# EAGLE design eth2dmx (EAGLE 9.2.2)
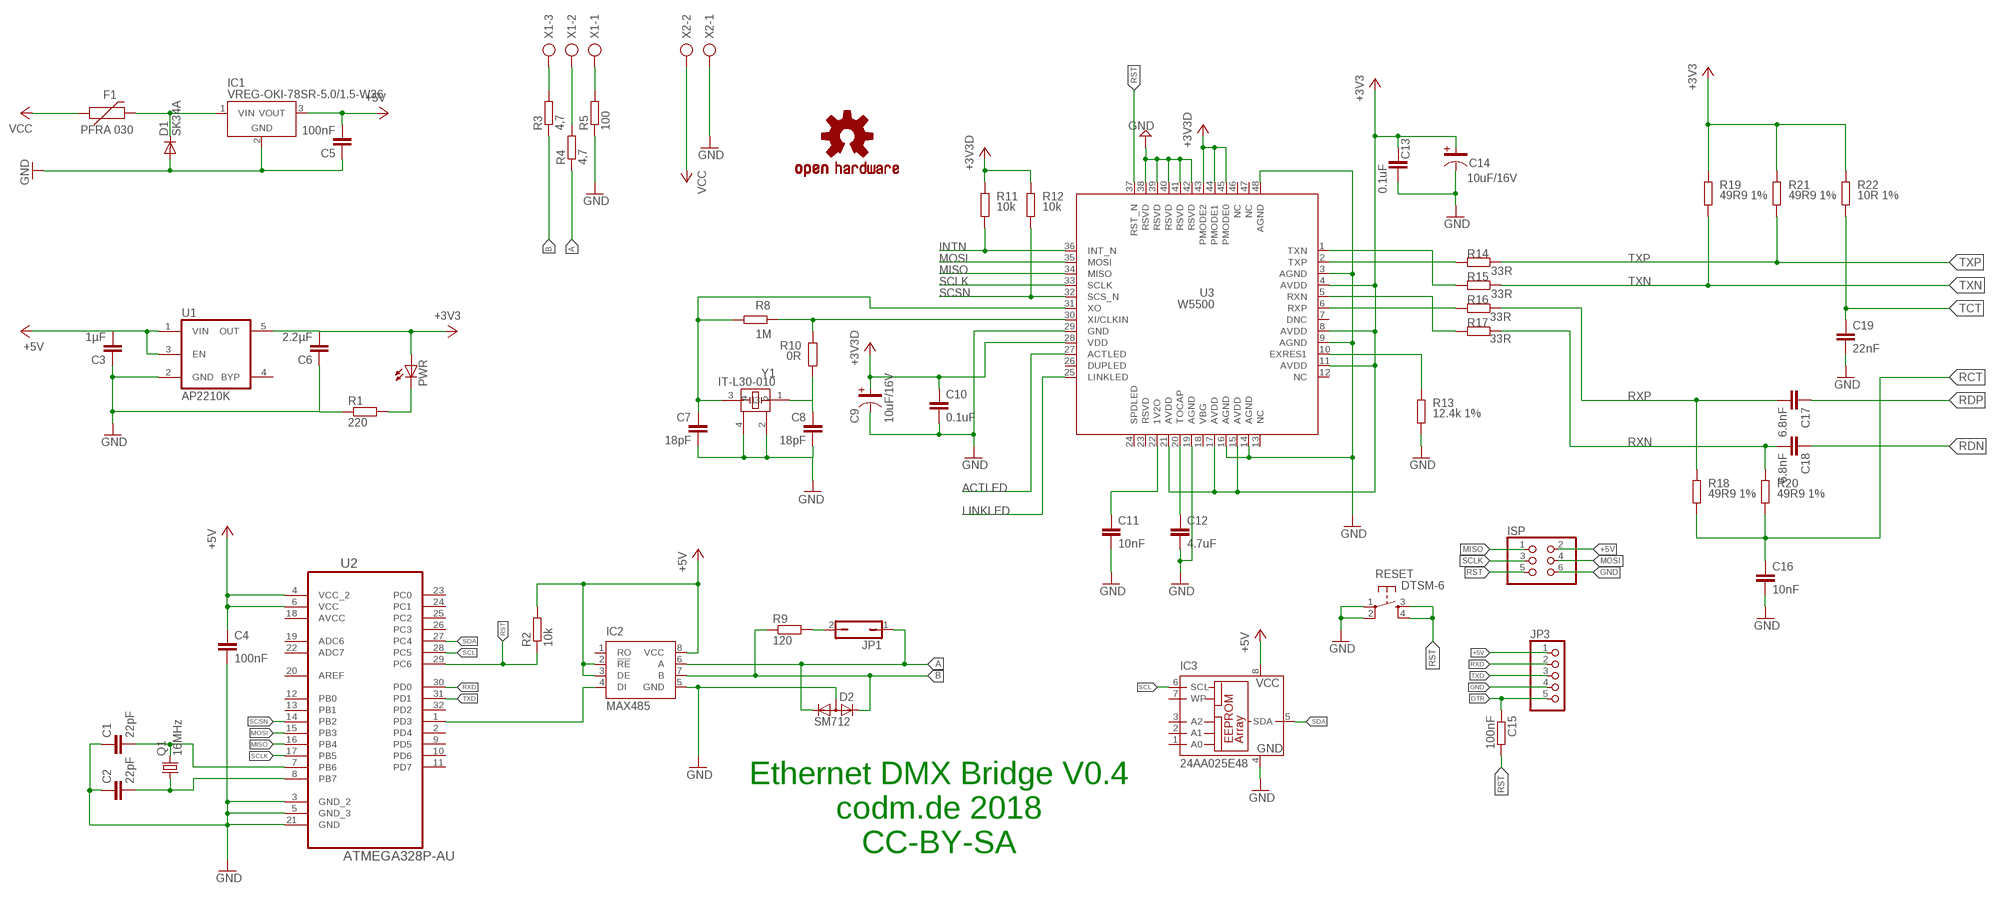
[diagram p0: schematic, sheet 1, part 1 of 2]
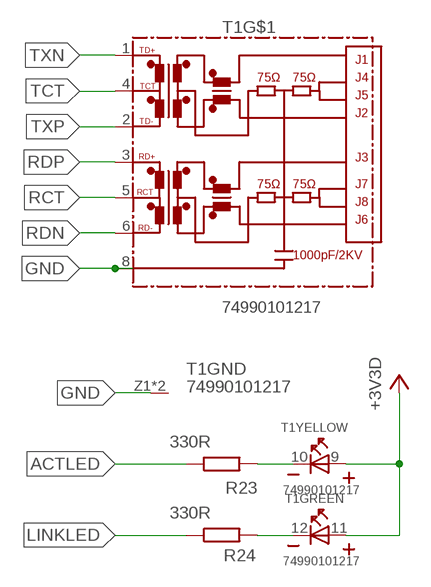
[diagram p1: schematic, sheet 1, part 2 of 2]

## Parts
C1  22pF  C-EUC0805  [C0805]
C2  22pF  C-EUC0805  [C0805]
C3  1µF  C-EUC0805  [C0805]
C4  100nF  C-EUC0805  [C0805]
C5  100nF  C-EUC0805  [C0805]
C6  2.2µF  C-EUC0805  [C0805]
C7  18pF  C-EUC0805  [C0805]
C8  18pF  C-EUC0805  [C0805]
C9  10uF/16V  C-3216(TANTAL)  [C-3216(TANTAL)]
C10  0.1uF  C-EUC0805  [C0805]
C11  10nF  C-EUC0805  [C0805]
C12  4.7uF  C-EUC0805  [C0805]
C13  0.1uF  C-EUC0805  [C0805]
C14  10uF/16V  C-3216(TANTAL)  [C-3216(TANTAL)]
C15  100nF  R-EU_R0805  [R0805]
C16  10nF  C-EUC0805  [C0805]
C17  6.8nF  C-EUC0805  [C0805]
C18  6.8nF  C-EUC0805  [C0805]
C19  22nF  C-EUC0805  [C0805]
D1  SK34A  DIODE-DO214AC  [DO214AC]
D2  SM712  DIODE-2CA|ACSOT23  [SOT23]
F1  PFRA 030  PPTC_PTH  [PTH]
IC1  VREG-OKI-78SR-5.0/1.5-W36  [OKI-78SR]
IC2  MAX485  LTC485S  [SOIC8]
IC3  24AA025E48  24AA02SN  [SO-08]
ISP  PINHD-2X3  [2X03]
JP1  JP1Q  [JP1]
JP3  PINHD-1X5  [1X05]
LOGO1  OSHW-LOGOM  [OSHW-LOGO-M]
PWR  LEDCHIP-LED0805  [CHIP-LED0805]
Q1  16MHz  CRYSTALHC49U70  [HC49U70]
R1  220  R-EU_R0805  [R0805]
R2  10k  R-EU_R0805  [R0805]
R3  4,7  R-EU_R0805  [R0805]
R4  4,7  R-EU_R0805  [R0805]
R5  100  R-EU_R0805  [R0805]
R8  1M  R-EU_R0805  [R0805]
R9  120  R-EU_R0805  [R0805]
R10  0R  R-EU_R0805  [R0805]
R11  10k  R-EU_R0805  [R0805]
R12  10k  R-EU_R0805  [R0805]
R13  12.4k 1%  R-EU_R0805  [R0805]
R14  33R  R-EU_R0805  [R0805]
R15  33R  R-EU_R0805  [R0805]
R16  33R  R-EU_R0805  [R0805]
R17  33R  R-EU_R0805  [R0805]
R18  49R9 1%  R-EU_R0805  [R0805]
R19  49R9 1%  R-EU_R0805  [R0805]
R20  49R9 1%  R-EU_R0805  [R0805]
R21  49R9 1%  R-EU_R0805  [R0805]
R22  10R 1%  R-EU_R0805  [R0805]
R23  330R  R-EU_R0805  [R0805]
R24  330R  R-EU_R0805  [R0805]
RESET  DTSM-6  [DTSM-6]
T1  74990101217  WE-RJ45_74990111217  [74990111217]
U1  AP2210K  [SOT23-5]
U2  ATMEGA328P-AU  [QFP80P900X900X120-32N]
U3  W5500  [W5500]
X1  AK500/3  [AK500/3]
X2  AK500/2  [AK500/2]
Y1  IT-L30-010  [IT-L30-010]

## Nets
+3V3: C6.2 C9.1 C10.1 C13.1 C14.1 PWR.A R11.2 R12.2 R19.2 R21.2 R22.2 T1.9(YELLOW:A) T1.11(GREEN:A) U1.5(OUT) U3.4(AVDD) U3.8(AVDD) U3.11(AVDD) U3.15(AVDD) U3.17(AVDD) U3.21(AVDD) U3.28(VDD) U3.43(PMODE2) U3.44(PMODE1) U3.45(PMODE0) ; supply symbol labelled +3V3D
+5V: C3.2 C4.1 C5.2 IC1.3(VOUT) IC2.2(!RE) IC2.3(DE) IC2.8(VCC) IC3.8(VCC) ISP.2 JP3.1 R2.2 U1.1(VIN) U1.3(EN) U2.4(VCC_2) U2.6(VCC)
A: D2.1(K1) IC2.6(A) JP1.1 R4.1
ACTLED: R23.1 U3.27(ACTLED)
B: D2.2(K2) IC2.7(B) R3.1 R9.1
DOUT: IC2.4(DI) U2.1(PD3)
DTR: C15.1 JP3.5
GND: C1.1 C2.1 C3.1 C4.2 C5.1 C6.1 C7.2 C8.2 C9.2 C10.2 C11.2 C12.2 C13.2 C14.2 C16.2 C19.2 D1.A D2.3(A) IC1.2(GND) IC2.5(GND) IC3.4(GND) ISP.6 JP3.4 R1.1 R5.1 R13.1 RESET.1 RESET.2 T1.8 T1.Z1(GND:GND) T1.Z2(GND:GND) U1.2(GND) U2.3(GND_2) U2.5(GND_3) U2.21(GND) U3.3(AGND) U3.9(AGND) U3.14(AGND) U3.16(AGND) U3.19(AGND) U3.29(GND) U3.38(RSVD) U3.39(RSVD) U3.40(RSVD) U3.41(RSVD) U3.42(RSVD) U3.48(AGND) X2.1 Y1.2 Y1.4
INTN: R11.1 U3.36(INT_N)
LINKLED: R24.1 U3.25(LINKLED)
MISO: ISP.1 U2.16(PB4) U3.34(MISO)
MOSI: ISP.4 U2.15(PB3) U3.35(MOSI)
N$1: C12.1 U3.20(TOCAP)
N$2: C2.2 Q1.1 U2.8(PB7)
N$3: C1.2 Q1.2 U2.7(PB6)
N$4: R5.2 X1.1
N$5: R3.2 X1.3
N$6: R4.2 X1.2
N$7: PWR.C R1.2
N$8: D1.C F1.P$2 IC1.1(VIN)
N$11: R8.2 R10.2 U3.30(XI/CLKIN)
N$13: JP1.2 R9.2
N$15: C11.1 U3.22(1V2O)
N$17: R13.2 U3.10(EXRES1)
N$20: R16.2 U3.6(RXP)
N$22: C7.1 R8.1 U3.31(XO) Y1.3
N$26: R17.2 U3.5(RXN)
N$27: R14.2 U3.2(TXP)
N$28: R15.2 U3.1(TXN)
N$29: C8.1 R10.1 Y1.1
N$34: R23.2 T1.10(YELLOW:K)
N$35: R24.2 T1.12(GREEN:K)
RCT: C16.1 R18.1 R20.1 T1.5(RCT)
RDN: C18.1 T1.6(RD-)
RDP: C17.1 T1.3(RD+)
RST: C15.2 ISP.5 R2.1 RESET.3 RESET.4 U2.29(PC6) U3.37(RST_N)
RXD: JP3.2 U2.30(PD0)
RXN: C18.2 R17.1 R20.2
RXP: C17.2 R16.1 R18.2
SCL: IC3.6(SCL) U2.28(PC5)
SCLK: ISP.3 U2.17(PB5) U3.33(SCLK)
SCSN: R12.1 U2.14(PB2) U3.32(SCS_N)
SDA: IC3.5(SDA) U2.27(PC4)
TCT: C19.1 R22.1 T1.4(TCT)
TXD: JP3.3 U2.31(PD1)
TXN: R15.1 R19.1 T1.1(TD+)
TXP: R14.1 R21.1 T1.2(TD-)
VCC: F1.P$1 X2.2
Unconnected: IC2.1(RO) IC3.1(A0) IC3.2(A1) IC3.3(A2) IC3.7(WP) U1.4(BYP) U2.2(PD4) U2.9(PD5) U2.10(PD6) U2.11(PD7) U2.12(PB0) U2.13(PB1) U2.19(ADC6) U2.20(AREF) U2.22(ADC7) U2.23(PC0) U2.24(PC1) U2.25(PC2) U2.26(PC3) U2.32(PD2) U3.7(DNC) U3.12(NC) U3.13(NC) U3.18(VBG) U3.23(RSVD) U3.24(SPDLED) U3.26(DUPLED) U3.46(NC) U3.47(NC)

## Notes on the sheet
- Ethernet DMX Bridge V0.4
  codm.de 2018
  CC-BY-SA

## Power pins joined to a net without a drawn wire
AVCC: U2.18(AVCC)

## Library data of the parts
C1-C8 C10-C13 C16-C19 = rcl:C-EU: CAPACITOR, European symbol; SPICEPREFIX: C
C9 C14 = CAP:C-3216(TANTAL)
C15 R1-R5 R8-R24 = rcl:R-EU_: RESISTOR, European symbol; SPICEPREFIX: R
D1 = diode:DIODE-: DIODE
D2 = diode:DIODE-2CA|AC: Dual DIODE Cathode-Anode|Anode-Cathode
F1 = SparkFun-Fuses:PPTC: Resettable Fuse PPTC Resettable Fuse. Really a sort of resistor with a polymeric positive temperature coefficient whose resistance increases dramatically with an increase in temperature. When heated by the power passing through the resistance rises causing the current to be limited, protecting the circuit. This is achieved by the transition of the polymer from a crystalline to an amorphous state where the conductive carbon separates breaking the conductive pathways found in the cool crystalline structure. When a PPTC cools back down it resumes conducting letting the circuit turn back on. SparkFun Products: SparkFun RedBoard - Programmed with Arduino <https://www.sparkfun.com/products/12757> Pro Micro - 5V/16MHz <https://www.sparkfun.com/products/12640> Arduino Pro 328 - 5V/16MHz <https://www.sparkfun.com/products/10915> MP3 Trigger <https://www.sparkfun.com/products/13720>; PROD_ID: RES-08490; VALUE: 72V/0.25A
IC1 = we-power:VREG: Voltage Regulators (LDOs, Switching Converters...) LDOs Taiwan Semi TS1117 800mA max 15V - compatible On Semi NCP1117 1A max 20V - compatible Diodes AP2111H 0.6A max 6V (0.25V@0.6A) - compatible Diodes AP2114H 1A max 6V (0.45V@1A) Taiwan Semi TS9011 250mA max 12V - compatible Diodes AP2210 300mA max 15V - compatible Microchip MCP1700 250mA max 6.5V - compatible Microchip MCP1702 250mA max 13V - compatible Microchip MCP1703 250mA max 16V - compatible Microchip MCP1754 150mA max 16V Taiwan Semi TS5204 150mA max 16V (low noise) DC/DC Converter Modules Recom R-78Ex.x-1.0-W36 1A max 28V - compatible CUI V78xx-2000 2A max 18V Murata OKI-78SR-x.x/1.5-W36 1.5A max 36V
IC2 = linear-technology:LTC485: Low Power RS485 Interface Transceiver Source: http://www.linear.com/pc/downloadDocument.do?navId=H0,C1,C1007,C1017,P2064,D1718; OC_FARNELL: unknown; OC_NEWARK: unknown
IC3 = microchip:24*: Serial EEPROM I2C; MPN: 24AA02/SN; OC_FARNELL: 1331272; OC_NEWARK: 89C9793
ISP = pinhead:PINHD-2X3: PIN HEADER
JP1 = jumper:JP1Q: JUMPER
JP3 = pinhead:PINHD-1X5: PIN HEADER
LOGO1 = SparkFun-Aesthetics:OSHW-LOGO: Open-Source Hardware (OSHW) Logo This logo indicates the piece of hardware it is found on incorporates a OSHW license and/or adheres to the definition of open source hardware found here: http://freedomdefined.org/OSHW
PWR = led:LED: LED OSRAM: - CHIPLED LG R971, LG N971, LY N971, LG Q971, LY Q971, LO R971, LY R971 LH N974, LH R974 LS Q976, LO Q976, LY Q976 LO Q996 - Hyper CHIPLED LW Q18S LB Q993, LB Q99A, LB R99A - SideLED LS A670, LO A670, LY A670, LG A670, LP A670 LB A673, LV A673, LT A673, LW A673 LH A674 LY A675 LS A676, LA A676, LO A676, LY A676, LW A676 LS A679, LY A679, LG A679 - Hyper Micro SIDELED® LS Y876, LA Y876, LO Y876, LY Y876 LT Y87S - SmartLED LW L88C, LW L88S LB L89C, LB L89S, LG L890 LS L89K, LO L89K, LY L89K LS L896, LA L896, LO L896, LY L896 - TOPLED LS T670, LO T670, LY T670, LG T670, LP T670 LSG T670, LSP T670, LSY T670, LOP T670, LYG T670 LG T671, LOG T671, LSG T671 LB T673, LV T673, LT T673, LW T673 LH T674 LS T676, LA T676, LO T676, LY T676, LB T676, LH T676, LSB T676, LW T676 LB T67C, LV T67C, LT T67C, LS T67K, LO T67K, LY T67K, LW E67C LS E67B, LA E67B, LO E67B, LY E67B, LB E67C, LV E67C, LT E67C LW T67C LS T679, LY T679, LG T679 LS T770, LO T770, LY T770, LG T770, LP T770 LB T773, LV T773, LT T773, LW T773 LH T774 LS E675, LA E675, LY E675, LS T675 LS T776, LA T776, LO T776, LY T776, LB T776 LHGB T686 LT T68C, LB T68C - Hyper Mini TOPLED® LB M676 - Mini TOPLED Santana® LG M470 LS M47K, LO M47K, LY M47K Source: http://www.osram.convergy.de LUXEON: - LUMILED® LXK2-PW12-R00, LXK2-PW12-S00, LXK2-PW14-U00, LXK2-PW14-V00 LXK2-PM12-R00, LXK2-PM12-S00, LXK2-PM14-U00 LXK2-PE12-Q00, LXK2-PE12-R00, LXK2-PE12-S00, LXK2-PE14-T00, LXK2-PE14-U00 LXK2-PB12-K00, LXK2-PB12-L00, LXK2-PB12-M00, LXK2-PB14-N00, LXK2-PB14-P00, LXK2-PB14-Q00 LXK2-PR12-L00, LXK2-PR12-M00, LXK2-PR14-Q00, LXK2-PR14-R00 LXK2-PD12-Q00, LXK2-PD12-R00, LXK2-PD12-S00 LXK2-PH12-R00, LXK2-PH12-S00 LXK2-PL12-P00, LXK2-PL12-Q00, LXK2-PL12-R00 Source: www.luxeon.com KINGBRIGHT: KA-3528ASYC Source: www.kingbright.com
Q1 = adafruit:CRYSTAL: CRYSTAL; OC_FARNELL: unknown; OC_NEWARK: unknown
RESET = switch-tact:DTSM-6
T1 = SignalCommunications (rev17d):WE-RJ45_74990111217: Order Code 74990111217 Design THT xBase-T 10/100 Base-T Ports 1x1 Application Standard HPLE Tab Position Up LED (Left-Right) yellow-green EMI Fingers YES <http://katalog.we-online.de/media/images/v2/Family_RJ45_drei(2).jpg> Details see: http://katalog.we-online.de/en/pbs/WE-LAN-RJ45/74990111217 <http://katalog.we-online.de/en/pbs/WE-LAN-RJ45/74990111217?> Created by Yingchun Shan 2014-07-10 2016 (C) Würth Elektronik
U1 = diodes-inc:AP2210: LDO REGULATOR
U2 = Atmel_By_element14_Batch_1-00:ATMEGA328P-AU: 8-bit Microcontroller with In-System Programmable Flash; MPN: ATMEGA328P-AU; OC_FARNELL: 1715486; OC_NEWARK: 14R4631; PACKAGE: TQFP-32; SUPPLIER: Atmel
U3 = W5500:W5500
X1 = con-ptr500:AK500/3: CONNECTOR; OC_FARNELL: unknown; OC_NEWARK: unknown
X2 = con-ptr500:AK500/2: CONNECTOR; OC_FARNELL: unknown; OC_NEWARK: unknown
Y1 = IT-L30-010:IT-L30-010

## Board
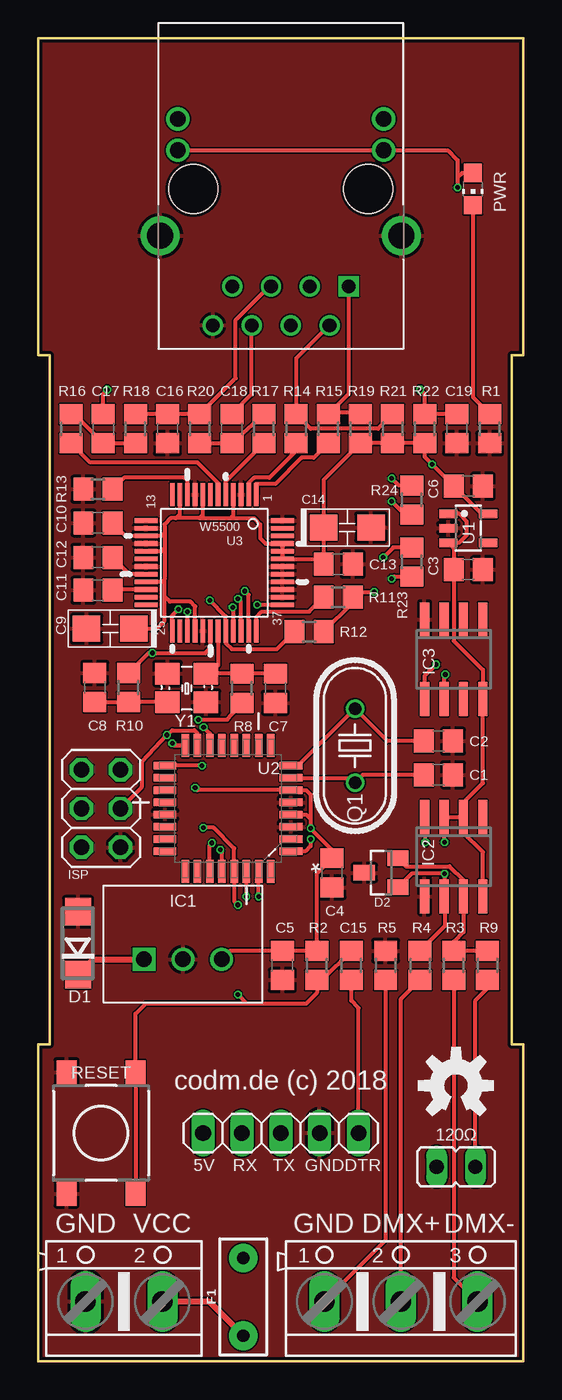
[diagram p2: board, top side]
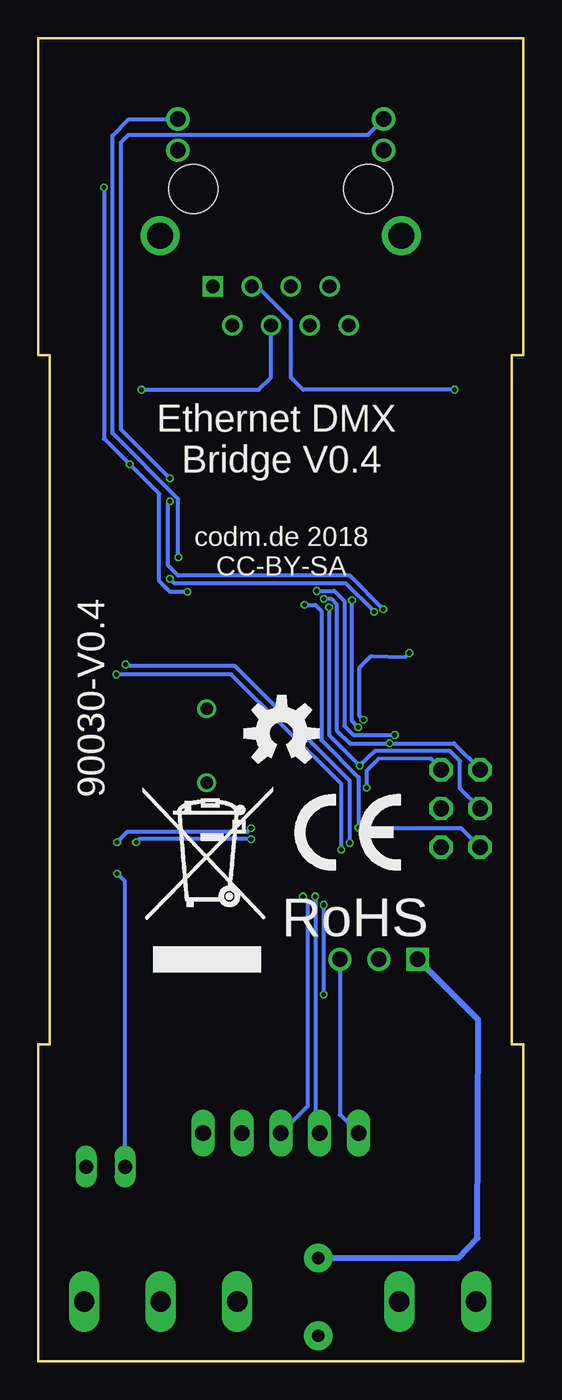
[diagram p3: board, bottom side, seen from below]

Size 31.7 x 86.4 mm. Coordinates in mm from the lower left corner, seen from the top.
Outline: 0,0 0,20.7 0.75,20.7 0.75,65.7 0,65.7 0,86.4 31.7,86.4 31.7,65.7 30.95,65.7 30.95,20.7 31.7,20.7 31.7,0 0,0
Copper layers (1*16): Top 0.018mm / dielectric 1.55mm / Bottom 0.018mm
Design rules "Multi-CB_2L_100um-Tracks_OL35um": minimum track width 0.1mm, minimum drill 0.2mm, track to track 0.1mm, track to pad 0.1mm, pad to pad 0.1mm, via to via 0.1mm, smd to smd 0mil, copper to edge 0.2mm, drill to drill 0.2mm, minimum pad ring 0.125mm, minimum via ring 0.1mm, stop-mask expansion 2mil, vias tented up to drill 0.45mm, thermal gap 0.2mm

### Footprints (pad centres in the part's own frame; a part is rotated, then mirrored left to right if it is on the bottom)
C0805 = smd 1.3 x 1.5: 1 -0.95,0; 2 0.95,0
C-3216(TANTAL) = smd 1.8 x 1.7: 1 1.55,0; 2 -1.55,0
R0805 = smd 1.3 x 1.5: 1 -0.95,0; 2 0.95,0
DO214AC = smd 1.8 x 1.7: A 2.05,0; C -2.05,0
SOT23 = smd 1 x 1.4: 1 -0.95,-1.1; 2 0.95,-1.1; 3 0,1.1
PTH = drill 0.8 pad 1.88: P$1 -2.54,0; P$2 2.54,0
OKI-78SR = drill 1 pad 1.5 square: 1 -2.54,0 | drill 1 pad 1.5: 2 0,0; 3 2.54,0
SOIC8 = smd 0.6 x 2.2: 1 -1.905,-2.6; 2 -0.635,-2.6; 3 0.635,-2.6; 4 1.905,-2.6; 5 1.905,2.6; 6 0.635,2.6; 7 -0.635,2.6; 8 -1.905,2.6
SO-08 = smd 0.6 x 2.2: 1 -1.905,-2.6; 2 -0.635,-2.6; 3 0.635,-2.6; 4 1.905,-2.6; 5 1.905,2.6; 6 0.635,2.6; 7 -0.635,2.6; 8 -1.905,2.6
2X03 = drill 1.016 octagon: 1 -2.54,-1.27; 2 -2.54,1.27; 3 0,-1.27; 4 0,1.27; 5 2.54,-1.27; 6 2.54,1.27
JP1 = drill 0.914 long: 1 0,-1.27; 2 0,1.27
1X05 = drill 1.016 long: 1 -5.08,0; 2 -2.54,0; 3 0,0; 4 2.54,0; 5 5.08,0
CHIP-LED0805 = smd 1.2 x 1.2: A 0,-1.05; C 0,1.05
HC49U70 = drill 0.813: 1 -2.413,0; 2 2.413,0
DTSM-6 = smd 1.55 x 1.3: 1 -3.975,2.25; 2 3.975,2.25; 3 -3.975,-2.25; 4 3.975,-2.25
74990111217 = drill 0.89 square: 1 4.44,-6.35 | drill 0.89: 2 3.18,-8.89; 3 1.9,-6.35; 4 0.64,-8.89; 5 -0.64,-6.35; 6 -1.9,-8.89; 7 -3.18,-6.35; 8 -4.44,-8.89 | drill 1.02: 9 6.725,2.54; 10 6.725,4.57; 11 -6.725,2.54; 12 -6.725,4.57 | drill 1.7: Z1 -7.875,-3.05; Z2 7.875,-3.05 | hole 3.2: -5.715,0; 5.715,0
SOT23-5 = smd 0.55 x 1.2: 1 -0.95,-1.3; 2 0,-1.3; 3 0.95,-1.3; 4 0.95,1.3; 5 -0.95,1.3
QFP80P900X900X120-32N = smd 1.473 x 0.508: 1 -4.115,2.794; 2 -4.115,2.007; 3 -4.115,1.194; 4 -4.115,0.406; 5 -4.115,-0.406; 6 -4.115,-1.194; 7 -4.115,-2.007; 8 -4.115,-2.794; 17 4.115,-2.794; 18 4.115,-2.007; 19 4.115,-1.194; 20 4.115,-0.406; 21 4.115,0.406; 22 4.115,1.194; 23 4.115,2.007; 24 4.115,2.794 | smd 0.508 x 1.473: 9 -2.794,-4.115; 10 -2.007,-4.115; 11 -1.194,-4.115; 12 -0.406,-4.115; 13 0.406,-4.115; 14 1.194,-4.115; 15 2.007,-4.115; 16 2.794,-4.115; 25 2.794,4.115; 26 2.007,4.115; 27 1.194,4.115; 28 0.406,4.115; 29 -0.406,4.115; 30 -1.194,4.115; 31 -2.007,4.115; 32 -2.794,4.115
W5500 = smd 1.5 x 0.3: 1 -4.45,2.75; 2 -4.45,2.25; 3 -4.45,1.75; 4 -4.45,1.25; 5 -4.45,0.75; 6 -4.45,0.25; 7 -4.45,-0.25; 8 -4.45,-0.75; 9 -4.45,-1.25; 10 -4.45,-1.75; 11 -4.45,-2.25; 12 -4.45,-2.75; 25 4.45,-2.75; 26 4.45,-2.25; 27 4.45,-1.75; 28 4.45,-1.25; 29 4.45,-0.75; 30 4.45,-0.25; 31 4.45,0.25; 32 4.45,0.75; 33 4.45,1.25; 34 4.45,1.75; 35 4.45,2.25; 36 4.45,2.75 | smd 0.3 x 1.5: 13 -2.75,-4.45; 14 -2.25,-4.45; 15 -1.75,-4.45; 16 -1.25,-4.45; 17 -0.75,-4.45; 18 -0.25,-4.45; 19 0.25,-4.45; 20 0.75,-4.45; 21 1.25,-4.45; 22 1.75,-4.45; 23 2.25,-4.45; 24 2.75,-4.45; 37 2.75,4.45; 38 2.25,4.45; 39 1.75,4.45; 40 1.25,4.45; 41 0.75,4.45; 42 0.25,4.45; 43 -0.25,4.45; 44 -0.75,4.45; 45 -1.25,4.45; 46 -1.75,4.45; 47 -2.25,4.45; 48 -2.75,4.45
AK500/3 = drill 1.321 long: 1 -5.004,0; 2 0,0; 3 5.004,0
AK500/2 = drill 1.321 long: 1 -2.515,0; 2 2.515,0
IT-L30-010 = smd 1.6 x 1.4: 1 -1.25,0; 2 1.25,0; 3 1.25,1.85; 4 -1.25,1.85

### Placement (x,y rotation side)
C1  26.15,38.3 180 top
C2  26.15,40.5 180 top
C3  28.1,51.7 180 top
C4  19.2,31.9 270 top
C5  15.95,25.85 90 top
C6  28.1,57.15 180 top
C7  15.5,43.95 270 top
C8  3.7,44 90 top
C9  4.7,47.85 0 top
C10  3.9,54.75 180 top
C11  3.9,50.35 180 top
C12  3.9,52.5 180 top
C13  19.6,52.05 0 top
C14  20.2,54.45 180 top
C15  20.45,25.85 90 top
C16  8.45,60.9 270 top
C17  4.25,60.9 270 top
C18  12.65,60.9 270 top
C19  27.35,60.9 270 top
D1  2.6,27.3 90 top
D2  22.4,31.9 90 top
F1  13.4,4.2 90 top
IC1  9.45,26.25 0 top
IC2  27.15,32.95 180 top
IC3  27.15,45.85 180 top
ISP  4.1,36.1 270 top
JP1  27.3,12.7 270 top
JP3  15.85,14.9 0 top
LOGO1  27.3,18 0 top
LOGO2  OSHW-LOGOM  [OSHW-LOGO-M]  15.8,41 0 bottom
PWR  28.4,76.55 180 top
Q1  20.7,40.2 270 top
R1  29.5,60.9 90 top
R2  18.2,25.85 90 top
R3  27.15,25.85 270 top
R4  24.95,25.85 270 top
R5  22.7,25.85 270 top
R8  13.3,43.95 270 top
R9  29.35,25.85 270 top
R10  5.9,44 90 top
R11  19.6,49.9 0 top
R12  17.7,47.65 0 top
R13  3.9,56.95 0 top
R14  16.85,60.9 270 top
R15  18.95,60.9 270 top
R16  2.15,60.9 270 top
R17  14.75,60.9 270 top
R18  6.35,60.9 270 top
R19  21.05,60.9 270 top
R20  10.55,60.9 270 top
R21  23.15,60.9 270 top
R22  25.25,60.9 270 top
R23  24.4,52.2 90 top
R24  24.4,56.25 90 top
RESET  4.1,14.9 90 top
T1  15.85,76.55 0 top
U1  28.1,54.4 270 top
U2  12.4,36.1 180 top
U3  11.5,52.15 270 top
U$1  [CE_5MM]  15,32 0 bottom
U$3  [WEEE-LOGO-8MM]  24.88,25.39 0 bottom
X1  23.7,3.9 0 top
X2  5.6,3.9 0 top
Y1  9.7,43.05 0 top

### Tracks (layer width: path | path; a pad name or v marks a point on that pad's centre or on a via)
+3V3  (via drill 0.3)
  Top 0.254: 8.25,53.1 8.25,51.05 | 8.25,54.1 8.25,53.1 | 8.25,54.1 8.25,54.65 8.65,55.05 9,55.05 | U3.17 8.05,52.9 8.25,53.1 | 8.25,54.1 8.05,53.9 U3.15 5.7,53.9 C10.1 | 10.55,55.05 9,55.05 | 10.55,55.05 12.55,55.05 | 12.55,55.05 12.75,55.25 U3.4 | U3.11 9.25,55.3 9,55.05 | U3.8 10.75,55.25 10.55,55.05 | U3.45 14.85,53.4 14.5,53.75 14.5,54.65 14.1,55.05 12.55,55.05 | C13.1 C14.1 18.65,57.55 R19.2 R21.2 R22.2 | U3.28 10.25,49.3 9.95,49.6 8.6,49.6 8.25,49.95 | 8.25,51.05 8.1,50.9 U3.21 | C9.1 7.75,47.85 8.25,48.35 8.25,49.95 | 8.25,49.95 8.25,51.05 | 18.65,51.8 C13.1 | 25.63,59.95 R22.2 | U1.5 28.95,55.35 C6.2 v25.73,58.58 25.25,59.05 R22.2 | U3.43 18.3,52.4 C13.1 | R12.2 20.55,49.55 R11.2 20.9,50.25 v21.95,50.25 | T1.11 T1.9 26.76,79.09 27.4,78.45 27.4,77.3 | 27.85,77.6 PWR.A 27.7,77.6 27.4,77.3 | 27.45,76.65 v27.4,76.65 27.4,77.3
  Top 0.305: U3.43 U3.45 U3.44
  Bottom 0.254: v27.4,76.65 27.4,60.25 v25.73,58.58 23.8,56.65 23.8,50.95 23.1,50.25 v21.95,50.25
+5V  (via drill 0.3)
  Top 0.254: v10.25,37.45 10.39,37.29 U2.6 17.51,37.29 17.8,37 17.8,35.4 | IC2.8 29.05,33.24 27.79,34.52 IC2.2 | IC2.3 26.55,35.55 | 26.55,35.55 IC2.2 | IC2.2 27.79,36.48 29.05,37.76 IC3.8 29.05,45.15 27.15,47.05 C3.2 27.15,53.1 U1.3 27.5,53.45 28,53.95 28,54.85 27.5,55.35 U1.1 | IC1.3 12.54,26.8 C5.2 R2.2 18.2,31.85 C4.1 19.2,33.4 v17.8,34.8 17.8,35.4 | U2.4 17.51,35.69 17.8,35.4 | v26.55,33.9 26.55,35.55
  Bottom 0.254: v17.8,34.8 18.05,34.55 25.9,34.55 v26.55,33.9 | ISP.2 5.37,38.67 6.05,39.35 9.46,39.34 10.25,38.55 v10.25,37.45 | IC1.3 11.99,16.12 JP3.1
A  (via drill 0.3)
  Top 0.254: IC2.6 26.57,29.9 | 26.57,29.9 26.57,28.41 R4.1 | 26.57,29.9 26.55,29.91 v26.55,31.85 24.4,31.85 D2.1
  Bottom 0.254: JP1.1 26.03,31.33 v26.55,31.85
ACTLED  (via drill 0.3)
  Top 0.254: U3.27 v9.75,48.95 | v23.1,51.1 23.25,51.25 R23.1
  Bottom 0.254: v9.75,48.95 11.6,50.8 22.8,50.8 v23.1,51.1
B
  Top 0.254: R9.1 R3.1 27.15,27.4 27.79,28.04 IC2.7 27.79,31.42 26.88,32.33 24.02,32.33 D2.2
DOUT  (via drill 0.3)
  Top 0.254: v25.3,33.9 25.3,35.2 IC2.4 | v17.8,34.1 17.8,33.65 17.46,33.31 U2.1
  Bottom 0.254: v17.8,34.1 25.1,34.1 v25.3,33.9
DTR
  Top 0.254: JP3.5 20.93,23.07 20.45,23.55 C15.1
GND
  pour Top: 0,0 0,87 32.1,87 32,0
INTN
  Top 0.254: U3.36 14.25,48.6 14.6,48.95 17.7,48.95 R11.1
LINKLED  (via drill 0.3)
  Top 0.254: U3.25 8.75,48.7 v9.15,49.1 | v23.1,56.15 23.95,55.3 R24.1
  Bottom 0.254: v9.15,49.1 11.35,51.3 22.55,51.3 23.2,51.95 23.2,56.05 v23.1,56.15
MISO  (via drill 0.3)
  Top 0.254: U3.34 13.25,49.6 v13.05,49.8
  Top 0.305: v8.75,40.35 8.87,40.22 U2.16
  Bottom 0.254: v13.05,49.8 12.55,49.8 12.2,49.45 12.2,41.2 11.35,40.35 v8.75,40.35 4.54,40.35 ISP.1
MOSI  (via drill 0.3)
  Top 0.254: U2.15 10.4,41 10.2,41.2 8.75,41.2 v8.4,40.9 6.75,39.15 6.75,37.48 ISP.4 | U3.35 13.75,50.05 v13.5,50.3
  Top 0.305: U2.15
  Bottom 0.254: v13.5,50.3 12.35,50.3 11.7,49.65 11.7,41.5 11.1,40.9 v8.4,40.9
N$1
  Top 0.254: U3.20 5.95,51.4 C12.1
N$2
  Top 0.254: U2.8 16.98,38.89 Q1.1 22.81,40.5 C2.2
N$3
  Top 0.254: C1.2 21.21,38.3 Q1.2 20.38,38.11 U2.7
N$4
  Top 0.254: R5.2 22.7,7.9 X1.1
N$5
  Top 0.254: R3.2 27.15,5.45 X1.3
N$6
  Top 0.254: X1.2 23.7,23.65 R4.2
N$7
  Top 0.254: PWR.C 28.4,62.95 R1.2
N$8
  Top 0.406: D1.C 3.6,26.25 IC1.1
  Bottom 0.406: F1.P$2 4.26,6.74 3,8.05 2.96,22.3 IC1.1
N$11  (via drill 0.3)
  Top 0.254: U3.30 11.25,46.6 10.9,46.25 v7.45,46.25 7.2,46.25 R10.2 | v10.45,41.9 12.35,41.9 R8.2
  Bottom 0.254: v10.45,41.9 10.7,42.15 10.7,45.3 9.95,46.05 7.7,46 v7.45,46.25
N$13
  Top 0.254: JP1.2 28.57,23.57 29.35,24.35 R9.2
N$15
  Top 0.254: U3.22 4.9,50.4 C11.1
N$17
  Top 0.254: U3.10 9.75,57.5 9.55,57.7 5.6,57.7 R13.2
N$20
  Top 0.254: R16.2 3.4,58.7 10.4,58.7 11.75,57.35 U3.6
N$22
  Top 0.254: C7.1 R8.1 11.2,44.9 | 11.2,44.9 Y1.3 | U3.31 11.75,45.45 11.2,44.9
N$26
  Top 0.254: U3.5 12.25,57.45 R17.2
N$27
  Top 0.254: U3.2 13.75,57.35 14.1,57.7 15.1,57.7 16.55,59.15 16.75,59.35 16.85,59.45 R14.2
N$28
  Top 0.254: R15.2 18,59 17.2,59 15.5,57.3 14.25,57.3 U3.1
N$29
  Top 0.254: C8.1 R10.1 Y1.1
N$34  (via drill 0.3)
  Top 0.254: R23.2 23.2,53.15 v22.55,52.5
  Bottom 0.254: v22.55,52.5 22.55,56.3 26.85,60.6 26.85,80.05 25.8,81.1 22.59,81.1 T1.10
N$35  (via drill 0.3)
  Top 0.254: R24.2 23.55,57.2 v23.1,57.65
  Bottom 0.254: v23.1,57.65 26.3,60.85 26.3,79.6 25.8,80.1 10.14,80.1 T1.12
RCT
  Top 0.254: T1.5 15.1,70.2 12.9,68 12.9,64.2 R20.1 C16.1 R18.1
RDN
  Top 0.254: C18.1 13.95,63.15 T1.6
RDP  (via drill 0.3)
  Top 0.254: C17.1 4.25,63.2 v4.5,63.45
  Bottom 0.254: v4.5,63.45 14.4,63.45 15.2,64.25 15.2,68 17.4,70.2 T1.3
RST  (via drill 0.3)
  Top 0.254: U3.37 v14.3,49.4 | C15.2 18.55,24.9 R2.1 18.2,24.05 17.5,23.35 13.65,23.35 | 13.65,23.35 7,23.35 6.35,22.7 RESET.4 RESET.3 | v13.05,23.95 13.65,23.35 | v13.05,29.8 12.81,30.04 U2.29 12.81,33.49 11.45,34.85 v10.78,34.85
  Bottom 0.254: v14.3,49.4 13.6,49.4 13.21,49.01 13.21,40.56 10.78,38.12 v10.78,34.85 10.62,34.8 4.07,34.8 ISP.5 | v13.05,29.8 v13.05,23.95
RXD  (via drill 0.3)
  Top 0.254: v13.6,30.35 13.6,31.98 U2.30
  Bottom 0.254: v13.6,30.35 13.6,15.19 JP3.2
RXN
  Top 0.254: R20.2 C18.2 R17.1
RXP
  Top 0.254: R18.2 C17.2 2.35,61.85 R16.1
SCL  (via drill 0.3)
  Top 0.254: U2.28 11.99,33.26 v11.9,33.4 | 26.6,43.34 IC3.6 26.52,44.77 v26.6,44.85
  Bottom 0.254: v26.6,44.85 19.1,44.85 11.9,37.7 v11.9,33.4
SCLK  (via drill 0.3)
  Top 0.254: U3.33 12.75,49.2 v12.7,49.25 | v10.7,38.9 U2.17
  Top 0.305: 8.19,38.8 U2.17
  Bottom 0.254: v12.7,49.25 12.7,40.9 v10.7,38.9 9.7,39.85 4.8,39.85 4.15,39.2 4.15,37.42 ISP.3
SCSN  (via drill 0.3)
  Top 0.254: v10.8,41.4 11.2,41 U2.14 | 12.25,46.98 U3.32 | U3.32 12.25,48.65 v11.2,49.7 | U3.32 12.25,46.9 12.65,46.5 15.6,46.5 R12.1
  Top 0.305: U2.14
  Bottom 0.254: v10.8,41.4 11.2,41.8 v11.2,49.7
SDA  (via drill 0.3)
  Top 0.254: U2.27 11.21,33.71 v11.35,33.85 | v26,45.5 25.25,44.76 IC3.5
  Bottom 0.254: v11.35,33.85 11.35,37.9 18.85,45.4 25.9,45.4 v26,45.5
TCT  (via drill 0.3)
  Top 0.254: C19.1 R22.1 25.25,63.15 v24.95,63.45
  Bottom 0.254: v24.95,63.45 17.3,63.45 16.5,64.25 T1.4
TXD  (via drill 0.3)
  Top 0.254: v14.4,30.35 14.4,31.98 U2.31
  Bottom 0.254: v14.4,30.35 14.1,30.05 14.1,16.65 JP3.3
TXN
  Top 0.254: R15.1 19.05,61.95 | 19.05,61.95 20.29,63.19 T1.1 | R19.1 20.95,61.95 19.05,61.95
TXP
  Top 0.254: R21.1 22.2,60.9 17.8,60.9 R14.1 16.85,65.48 T1.2
VCC
  Top 0.406: X2.2 11.16,3.9 F1.P$1

### Text on the board
tNames: codm.de (c) 2018 | 120Ω | 5V | RX | TX | GND | DTR | GND | VCC | GND | DMX+ | DMX-
bNames: Ethernet DMX / Bridge V0.4 | codm.de 2018 / CC-BY-SA | 90030-V0.4 | RoHS
tValues: 5V FOCA